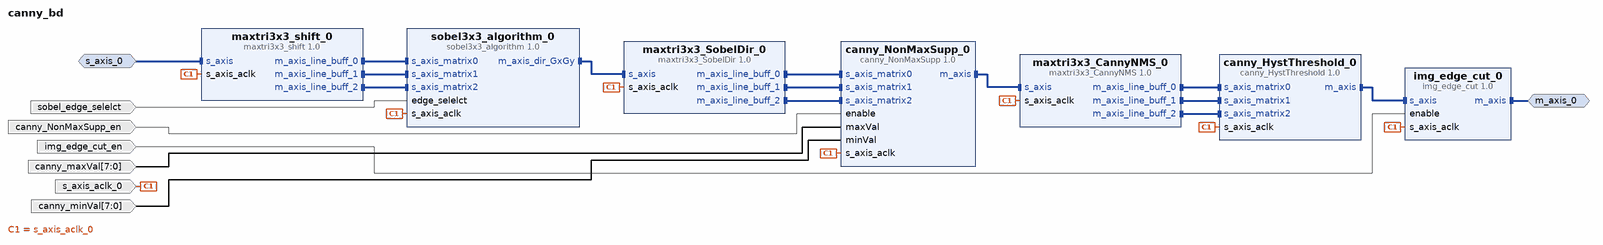
[diagram p0: block diagram of the top level]
# Vivado block design canny_bd, xc7z020clg400-1, Vivado 2018.1
create_bd_design canny_bd

create_bd_intf_port -mode Slave -vlnv xilinx.com:interface:axis_rtl:1.0 s_axis_0
set_property -dict [list \
  CONFIG.TDATA_NUM_BYTES 1 \
  CONFIG.TDEST_WIDTH 0 \
  CONFIG.TID_WIDTH 0 \
  CONFIG.TUSER_WIDTH 1 \
  CONFIG.HAS_TREADY 1 \
  CONFIG.HAS_TSTRB 0 \
  CONFIG.HAS_TKEEP 0 \
  CONFIG.HAS_TLAST 1 \
  CONFIG.LAYERED_METADATA undef \
] [get_bd_intf_ports s_axis_0]
create_bd_intf_port -mode Master -vlnv xilinx.com:interface:axis_rtl:1.0 m_axis_0
create_bd_port -dir I -type clk s_axis_aclk_0
create_bd_port -dir I sobel_edge_selelct
create_bd_port -dir I canny_NonMaxSupp_en
create_bd_port -dir I img_edge_cut_en
create_bd_port -dir I -from 7 -to 0 canny_maxVal
create_bd_port -dir I -from 7 -to 0 canny_minVal

create_bd_cell -type ip -vlnv xilinx.com:user:sobel3x3_algorithm:1.0 sobel3x3_algorithm_0
create_bd_cell -type ip -vlnv xilinx.com:user:maxtri3x3_SobelDir:1.0 maxtri3x3_SobelDir_0
create_bd_cell -type ip -vlnv xilinx.com:user:canny_NonMaxSupp:1.0 canny_NonMaxSupp_0
create_bd_cell -type ip -vlnv xilinx.com:user:maxtri3x3_CannyNMS:1.0 maxtri3x3_CannyNMS_0
create_bd_cell -type ip -vlnv xilinx.com:user:canny_HystThreshold:1.0 canny_HystThreshold_0
create_bd_cell -type ip -vlnv xilinx.com:user:img_edge_cut:1.0 img_edge_cut_0
create_bd_cell -type ip -vlnv xilinx.com:user:maxtri3x3_shift:1.0 maxtri3x3_shift_0

# ---- connections ----

connect_bd_intf_net [get_bd_intf_pins maxtri3x3_shift_0/m_axis_line_buff_0] [get_bd_intf_pins sobel3x3_algorithm_0/s_axis_matrix0]
connect_bd_intf_net [get_bd_intf_pins maxtri3x3_shift_0/m_axis_line_buff_1] [get_bd_intf_pins sobel3x3_algorithm_0/s_axis_matrix1]
connect_bd_intf_net [get_bd_intf_pins maxtri3x3_shift_0/m_axis_line_buff_2] [get_bd_intf_pins sobel3x3_algorithm_0/s_axis_matrix2]
connect_bd_intf_net [get_bd_intf_pins sobel3x3_algorithm_0/m_axis_dir_GxGy] [get_bd_intf_pins maxtri3x3_SobelDir_0/s_axis]
connect_bd_intf_net [get_bd_intf_pins maxtri3x3_SobelDir_0/m_axis_line_buff_0] [get_bd_intf_pins canny_NonMaxSupp_0/s_axis_matrix0]
connect_bd_intf_net [get_bd_intf_pins maxtri3x3_SobelDir_0/m_axis_line_buff_1] [get_bd_intf_pins canny_NonMaxSupp_0/s_axis_matrix1]
connect_bd_intf_net [get_bd_intf_pins maxtri3x3_SobelDir_0/m_axis_line_buff_2] [get_bd_intf_pins canny_NonMaxSupp_0/s_axis_matrix2]
connect_bd_intf_net [get_bd_intf_pins canny_NonMaxSupp_0/m_axis] [get_bd_intf_pins maxtri3x3_CannyNMS_0/s_axis]
connect_bd_intf_net [get_bd_intf_pins maxtri3x3_CannyNMS_0/m_axis_line_buff_0] [get_bd_intf_pins canny_HystThreshold_0/s_axis_matrix0]
connect_bd_intf_net [get_bd_intf_pins maxtri3x3_CannyNMS_0/m_axis_line_buff_1] [get_bd_intf_pins canny_HystThreshold_0/s_axis_matrix1]
connect_bd_intf_net [get_bd_intf_pins maxtri3x3_CannyNMS_0/m_axis_line_buff_2] [get_bd_intf_pins canny_HystThreshold_0/s_axis_matrix2]
connect_bd_intf_net [get_bd_intf_pins canny_HystThreshold_0/m_axis] [get_bd_intf_pins img_edge_cut_0/s_axis]
connect_bd_intf_net -intf_net s_axis_0_1 [get_bd_intf_ports s_axis_0] [get_bd_intf_pins maxtri3x3_shift_0/s_axis]
connect_bd_intf_net [get_bd_intf_ports m_axis_0] [get_bd_intf_pins img_edge_cut_0/m_axis]
connect_bd_net -net s_axis_aclk_0_1 [get_bd_ports s_axis_aclk_0] \
  [get_bd_pins sobel3x3_algorithm_0/s_axis_aclk] [get_bd_pins maxtri3x3_SobelDir_0/s_axis_aclk] \
  [get_bd_pins canny_NonMaxSupp_0/s_axis_aclk] [get_bd_pins maxtri3x3_CannyNMS_0/s_axis_aclk] \
  [get_bd_pins canny_HystThreshold_0/s_axis_aclk] [get_bd_pins img_edge_cut_0/s_axis_aclk] \
  [get_bd_pins maxtri3x3_shift_0/s_axis_aclk]
connect_bd_net -net edge_selelct_0_1 [get_bd_ports sobel_edge_selelct] [get_bd_pins sobel3x3_algorithm_0/edge_selelct]
connect_bd_net -net enable_0_1 [get_bd_ports canny_NonMaxSupp_en] [get_bd_pins canny_NonMaxSupp_0/enable]
connect_bd_net -net enable_0_2 [get_bd_ports img_edge_cut_en] [get_bd_pins img_edge_cut_0/enable]
connect_bd_net -net maxVal_0_1 [get_bd_ports canny_maxVal] [get_bd_pins canny_NonMaxSupp_0/maxVal]
connect_bd_net -net minVal_0_1 [get_bd_ports canny_minVal] [get_bd_pins canny_NonMaxSupp_0/minVal]

validate_bd_design
save_bd_design
